# EAGLE schematic reset (EAGLE 6.5.0)
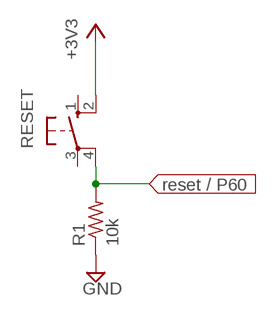
[diagram p0: schematic, sheet 1]

## Parts
R1  10k  R-US_0204/7  [0204/7]
RESET  40-XX  [B3F-40XX]

## Nets
+3V3: RESET.2(S1)
GND: R1.1
N$1: R1.2 RESET.4(P1)
Unconnected: RESET.1(S) RESET.3(P)

## Library data of the parts
R1 = resistor:R-US_: RESISTOR, American symbol
RESET = adafruit:40-XX: OMRON SWITCH; MF: OMRON COMPONENTS USA; MPN: B3F-4000; OC_FARNELL: 176434; OC_NEWARK: 36K3105